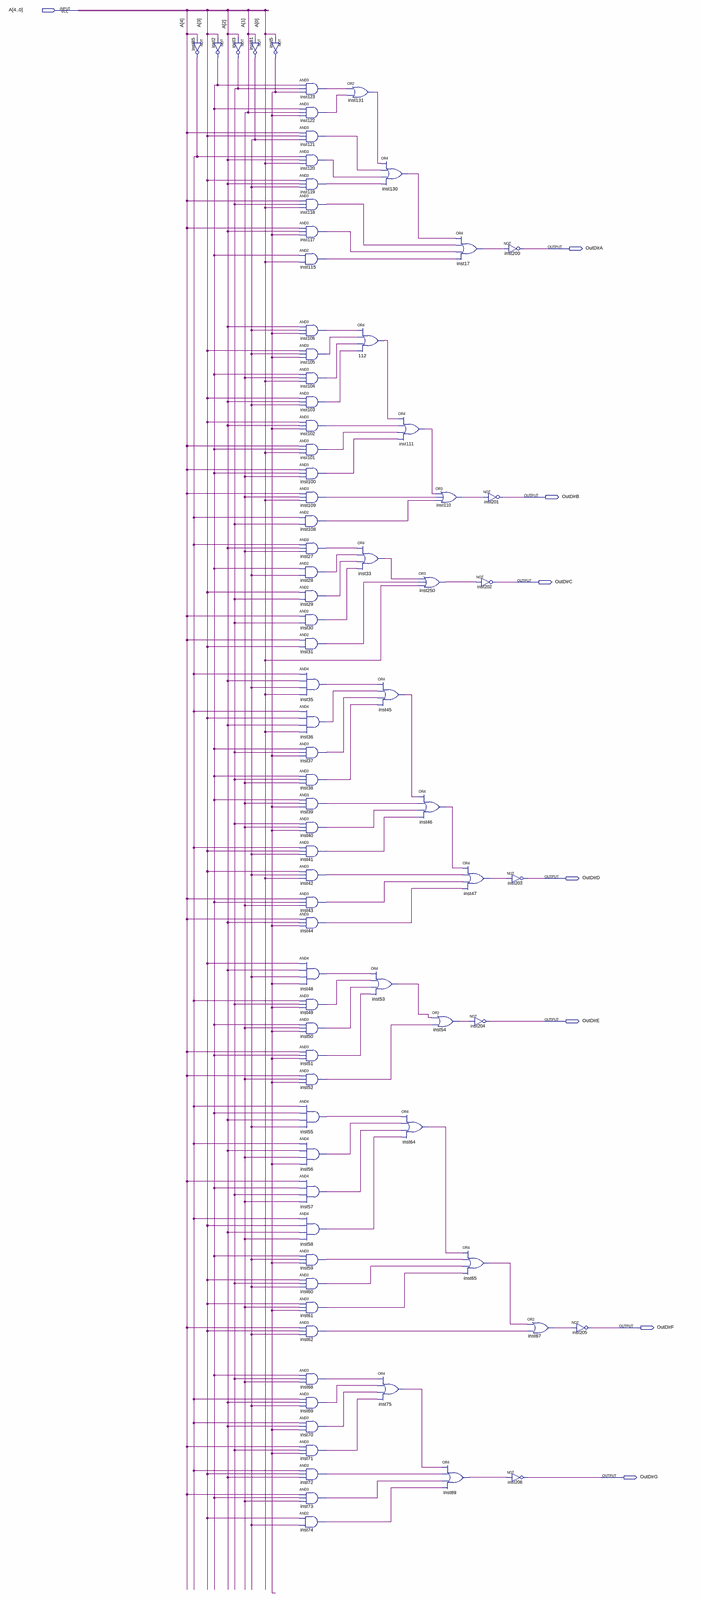
[diagram p0: schematic sheet, whole]
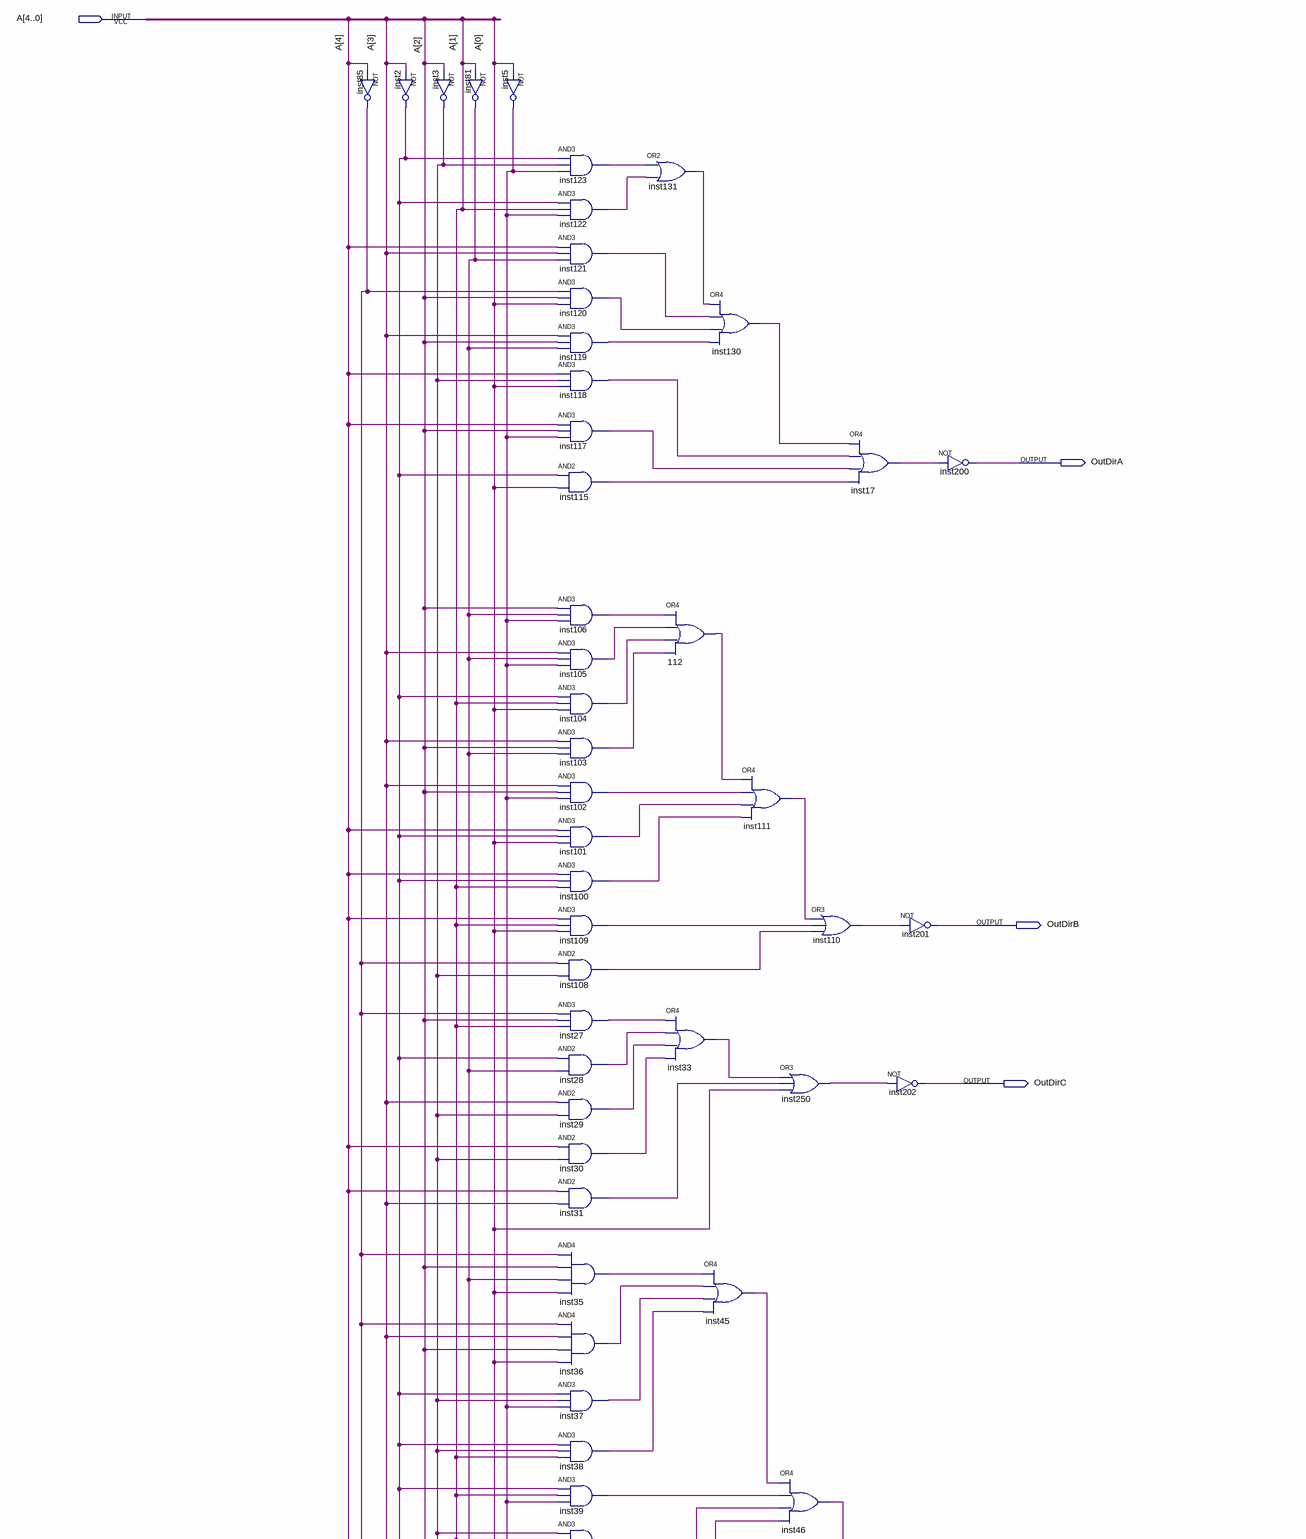
[diagram p1: schematic sheet, upper part]
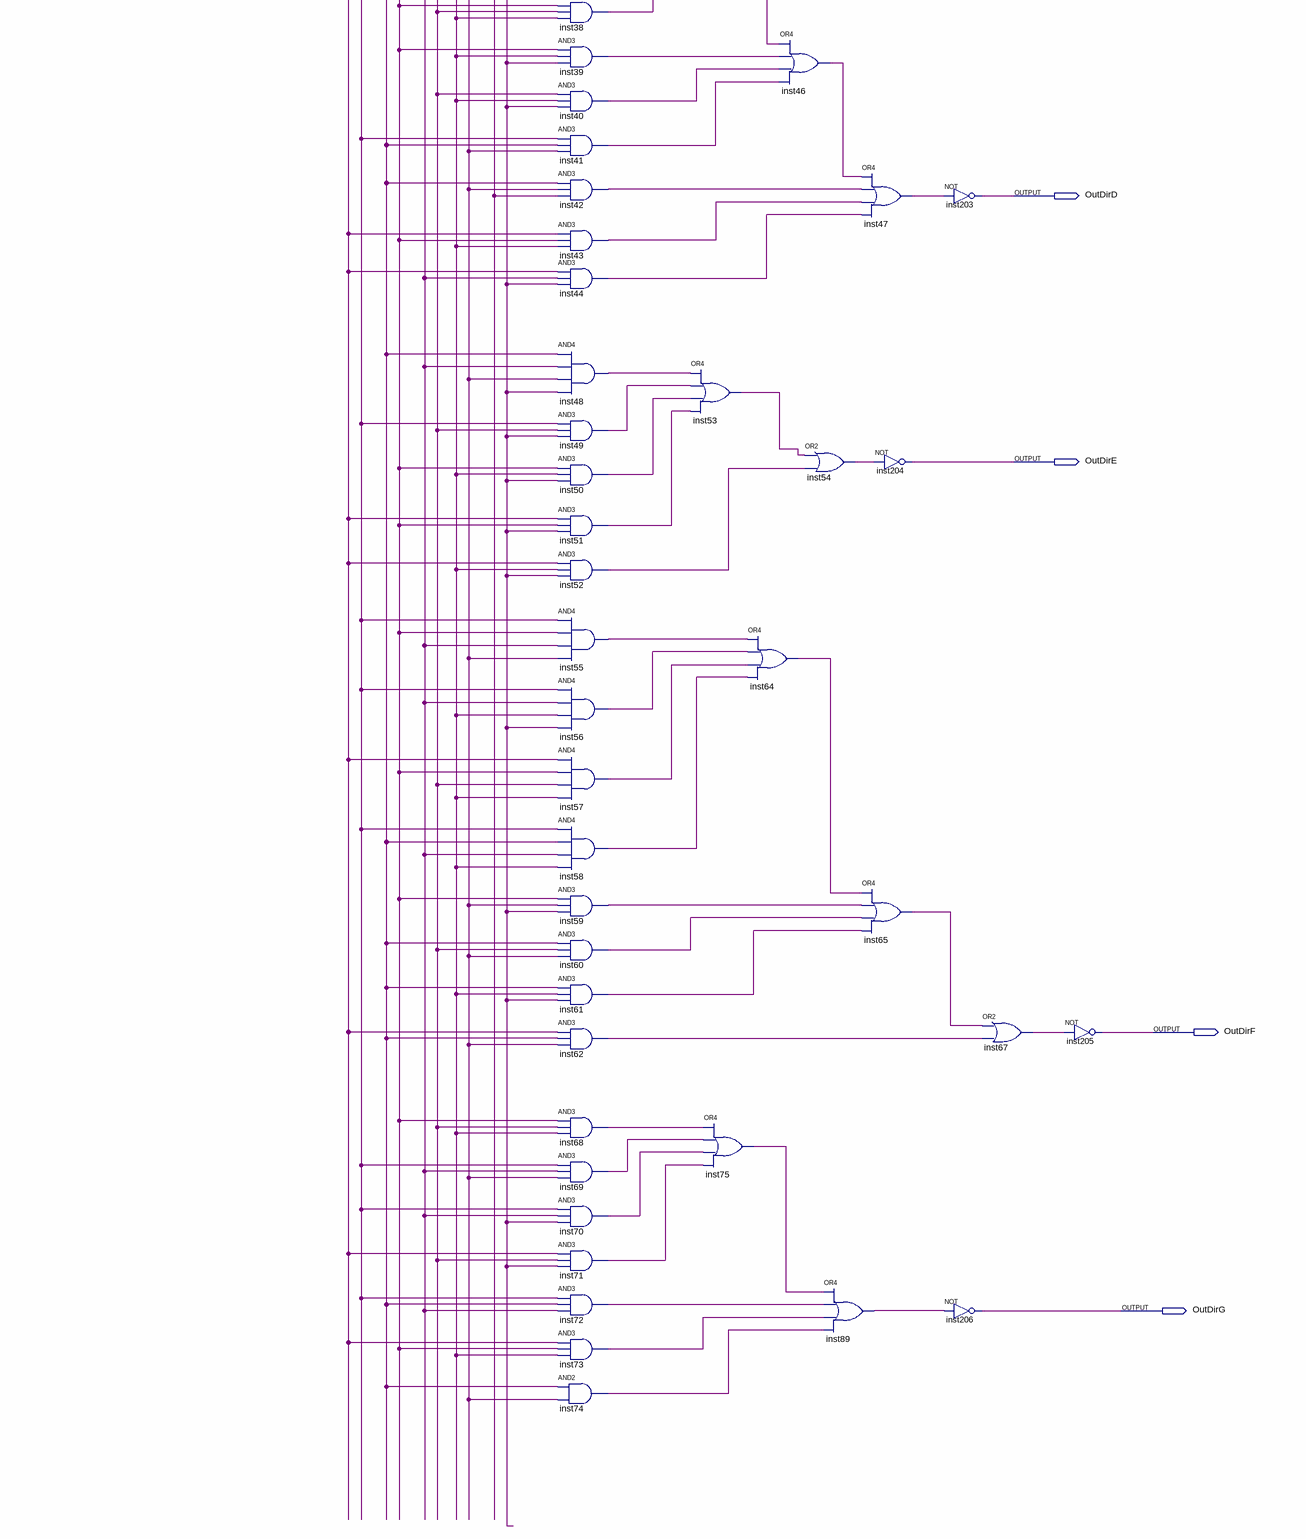
[diagram p2: schematic sheet, lower part]
// Quartus schematic DisplayDirSaida.bdf as structural Verilog: 82 symbols, 8 pins
module DisplayDirSaida (
  input  [4:0] A,
  output OutDirA,
  output OutDirB,
  output OutDirC,
  output OutDirD,
  output OutDirE,
  output OutDirF,
  output OutDirG
);

  wire inst2_out, inst3_out, inst5_out, inst17_out, inst27_out, inst28_out, inst29_out, inst30_out,
       inst31_out, inst33_out, inst35_out, inst36_out, inst37_out, inst38_out, inst39_out, inst40_out,
       inst41_out, inst42_out, inst43_out, inst44_out, inst45_out, inst46_out, inst47_out, inst48_out,
       inst49_out, inst50_out, inst51_out, inst52_out, inst53_out, inst54_out, inst55_out, inst56_out,
       inst57_out, inst58_out, inst59_out, inst60_out, inst61_out, inst62_out, inst64_out, inst65_out,
       inst67_out, inst68_out, inst69_out, inst70_out, inst71_out, inst72_out, inst73_out, inst74_out,
       inst75_out, inst81_out, inst85_out, inst89_out, inst100_out, inst101_out, inst102_out, inst103_out,
       inst104_out, inst105_out, inst106_out, inst108_out, inst109_out, inst110_out, inst111_out,
       inst115_out, inst117_out, inst118_out, inst119_out, inst120_out, inst121_out, inst122_out,
       inst123_out, inst130_out, inst131_out, inst250_out, n112_out;

  not inst85 (inst85_out, A[4]);
  not inst2 (inst2_out, A[3]);
  not inst3 (inst3_out, A[2]);
  not inst81 (inst81_out, A[1]);
  not inst5 (inst5_out, A[0]);
  and inst123 (inst123_out, inst2_out, inst3_out, inst5_out);
  and inst122 (inst122_out, inst2_out, A[1], inst5_out);
  and inst121 (inst121_out, A[4], A[3], inst81_out);
  and inst120 (inst120_out, inst85_out, A[2], A[0]);
  and inst119 (inst119_out, A[3], A[2], inst81_out);
  and inst118 (inst118_out, A[4], inst3_out, A[0]);
  and inst117 (inst117_out, A[4], A[2], inst5_out);
  and inst115 (inst115_out, inst2_out, A[0]);
  and inst106 (inst106_out, A[2], inst81_out, inst5_out);
  and inst105 (inst105_out, A[3], inst81_out, inst5_out);
  and inst104 (inst104_out, inst2_out, A[1], A[0]);
  and inst103 (inst103_out, A[3], A[2], inst81_out);
  and inst102 (inst102_out, A[3], A[2], inst5_out);
  and inst101 (inst101_out, A[4], inst2_out, A[0]);
  and inst100 (inst100_out, A[4], inst2_out, A[1]);
  and inst109 (inst109_out, A[4], A[1], A[0]);
  and inst108 (inst108_out, inst85_out, inst3_out);
  and inst27 (inst27_out, inst85_out, A[2], A[1]);
  and inst28 (inst28_out, inst2_out, inst81_out);
  and inst29 (inst29_out, A[3], inst3_out);
  and inst30 (inst30_out, A[4], inst3_out);
  and inst31 (inst31_out, A[4], A[3]);
  and inst35 (inst35_out, inst85_out, A[2], inst81_out, A[0]);
  and inst36 (inst36_out, inst85_out, A[3], A[2], A[0]);
  and inst37 (inst37_out, inst2_out, inst3_out, inst5_out);
  and inst38 (inst38_out, inst2_out, inst3_out, A[1]);
  and inst39 (inst39_out, inst2_out, A[1], inst5_out);
  and inst40 (inst40_out, inst3_out, A[1], inst5_out);
  and inst41 (inst41_out, inst85_out, A[3], inst81_out);
  and inst42 (inst42_out, A[3], inst81_out, A[0]);
  and inst43 (inst43_out, A[4], inst2_out, A[1]);
  and inst44 (inst44_out, A[4], A[2], inst5_out);
  and inst48 (inst48_out, A[3], A[2], inst81_out, inst5_out);
  and inst49 (inst49_out, inst85_out, inst3_out, inst5_out);
  and inst50 (inst50_out, inst2_out, A[1], inst5_out);
  and inst51 (inst51_out, A[4], inst2_out, inst5_out);
  and inst52 (inst52_out, A[4], A[1], inst5_out);
  and inst55 (inst55_out, inst85_out, inst2_out, A[2], inst81_out);
  and inst56 (inst56_out, inst85_out, A[2], A[1], inst5_out);
  and inst57 (inst57_out, A[4], inst2_out, inst3_out, A[1]);
  and inst58 (inst58_out, inst85_out, A[3], A[2], A[1]);
  and inst59 (inst59_out, inst2_out, inst81_out, inst5_out);
  and inst60 (inst60_out, A[3], inst3_out, inst81_out);
  and inst61 (inst61_out, A[3], A[1], inst5_out);
  and inst62 (inst62_out, A[4], A[3], inst81_out);
  and inst68 (inst68_out, inst2_out, inst3_out, A[1]);
  and inst69 (inst69_out, inst85_out, A[2], inst81_out);
  and inst70 (inst70_out, inst85_out, A[2], inst5_out);
  and inst71 (inst71_out, A[4], inst3_out, inst5_out);
  and inst72 (inst72_out, inst85_out, A[3], A[2]);
  and inst73 (inst73_out, A[4], inst2_out, A[1]);
  and inst74 (inst74_out, A[3], inst81_out);
  or inst131 (inst131_out, inst123_out, inst122_out);
  or u_112 (n112_out, inst106_out, inst105_out, inst104_out, inst103_out);
  or inst33 (inst33_out, inst27_out, inst28_out, inst29_out, inst30_out);
  or inst130 (inst130_out, inst131_out, inst121_out, inst120_out, inst119_out);
  or inst45 (inst45_out, inst35_out, inst36_out, inst37_out, inst38_out);
  or inst53 (inst53_out, inst48_out, inst49_out, inst50_out, inst51_out);
  or inst75 (inst75_out, inst68_out, inst69_out, inst70_out, inst71_out);
  or inst111 (inst111_out, n112_out, inst102_out, inst101_out, inst100_out);
  or inst64 (inst64_out, inst55_out, inst56_out, inst57_out, inst58_out);
  or inst110 (inst110_out, inst111_out, inst109_out, inst108_out);
  or inst250 (inst250_out, inst33_out, inst31_out, A[0]);
  or inst46 (inst46_out, inst45_out, inst39_out, inst40_out, inst41_out);
  or inst54 (inst54_out, inst53_out, inst52_out);
  or inst89 (inst89_out, inst75_out, inst72_out, inst73_out, inst74_out);
  or inst17 (inst17_out, inst130_out, inst118_out, inst117_out, inst115_out);
  or inst47 (inst47_out, inst46_out, inst42_out, inst43_out, inst44_out);
  not inst204 (OutDirE, inst54_out);
  or inst65 (inst65_out, inst64_out, inst59_out, inst60_out, inst61_out);
  not inst201 (OutDirB, inst110_out);
  not inst202 (OutDirC, inst250_out);
  not inst200 (OutDirA, inst17_out);
  not inst203 (OutDirD, inst47_out);
  not inst206 (OutDirG, inst89_out);
  or inst67 (inst67_out, inst65_out, inst62_out);
  not inst205 (OutDirF, inst67_out);
endmodule
